# EAGLE design 5853-base-board (EAGLE 6.2)
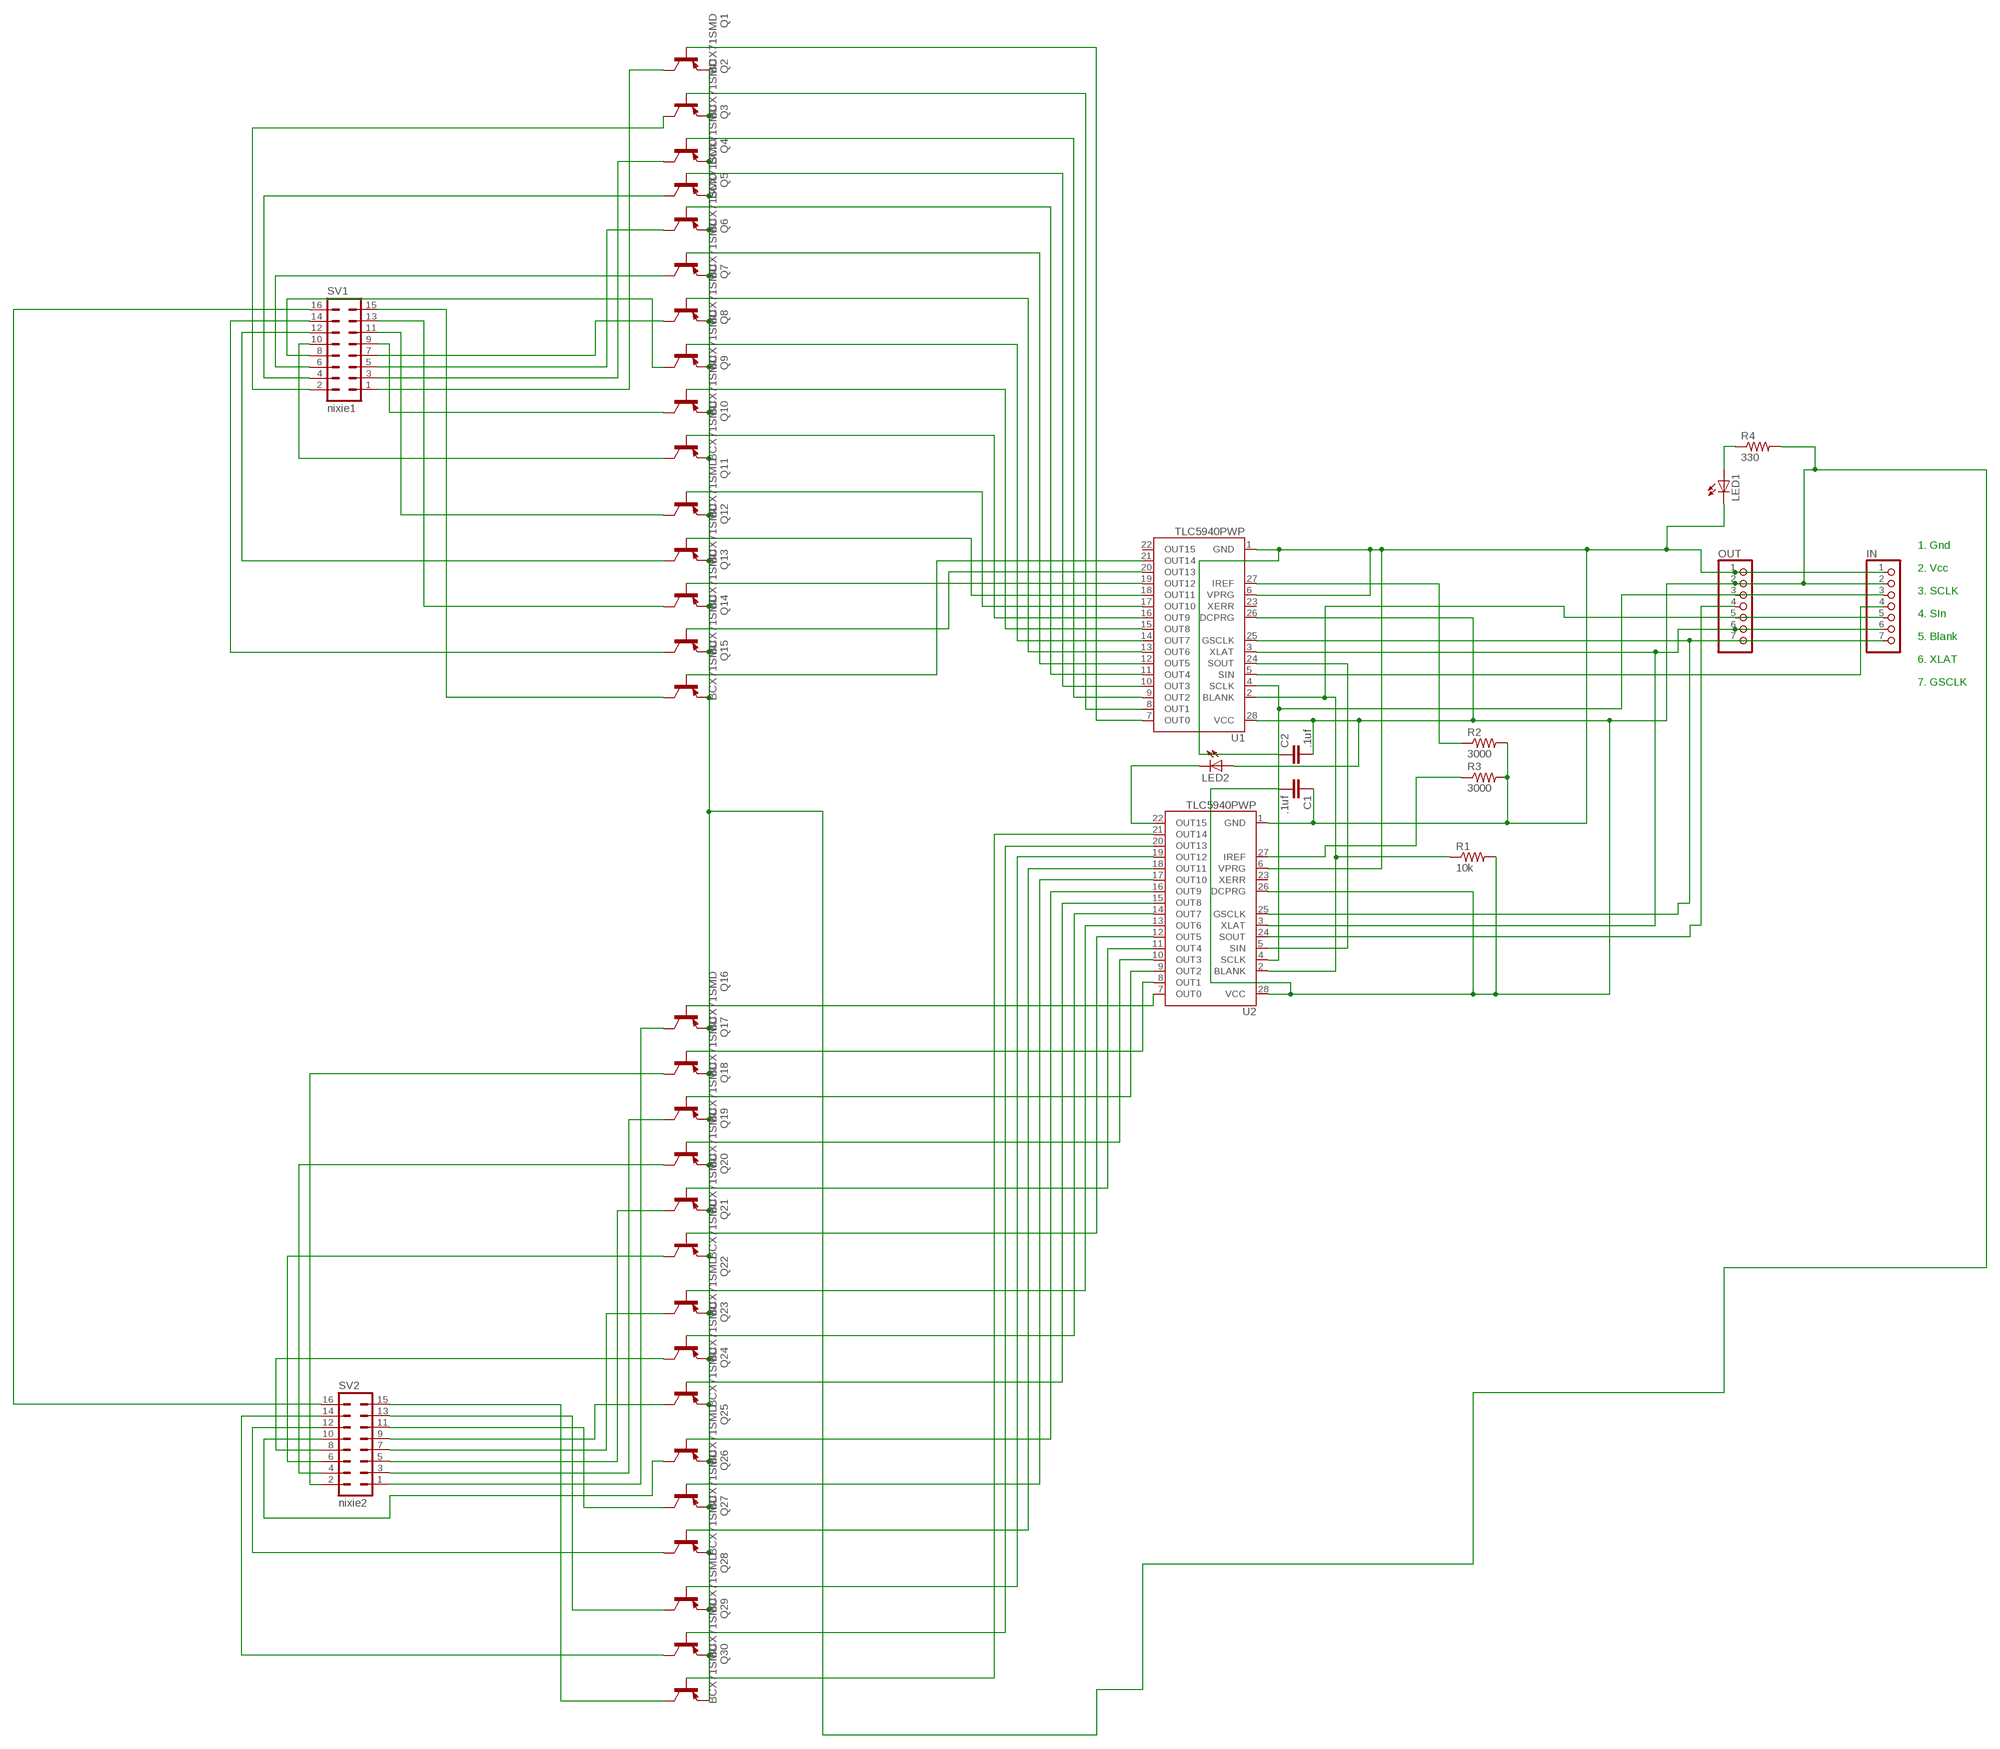
[diagram p0: schematic, sheet 1]

## Parts
C1  .1uf  C-EUC0805K  [C0805K]
C2  .1uf  C-EUC0805K  [C0805K]
IN  PINHD-1X7  [1X07]
LED1  LEDCHIPLED_0603  [CHIPLED_0603]
LED2  LEDCHIPLED_0603  [CHIPLED_0603]
OUT  PINHD-1X7  [1X07]
Q1  BCX71SMD  [SOT23]
Q2  BCX71SMD  [SOT23]
Q3  BCX71SMD  [SOT23]
Q4  BCX71SMD  [SOT23]
Q5  BCX71SMD  [SOT23]
Q6  BCX71SMD  [SOT23]
Q7  BCX71SMD  [SOT23]
Q8  BCX71SMD  [SOT23]
Q9  BCX71SMD  [SOT23]
Q10  BCX71SMD  [SOT23]
Q11  BCX71SMD  [SOT23]
Q12  BCX71SMD  [SOT23]
Q13  BCX71SMD  [SOT23]
Q14  BCX71SMD  [SOT23]
Q15  BCX71SMD  [SOT23]
Q16  BCX71SMD  [SOT23]
Q17  BCX71SMD  [SOT23]
Q18  BCX71SMD  [SOT23]
Q19  BCX71SMD  [SOT23]
Q20  BCX71SMD  [SOT23]
Q21  BCX71SMD  [SOT23]
Q22  BCX71SMD  [SOT23]
Q23  BCX71SMD  [SOT23]
Q24  BCX71SMD  [SOT23]
Q25  BCX71SMD  [SOT23]
Q26  BCX71SMD  [SOT23]
Q27  BCX71SMD  [SOT23]
Q28  BCX71SMD  [SOT23]
Q29  BCX71SMD  [SOT23]
Q30  BCX71SMD  [SOT23]
R1  10k  R-US_R0603  [R0603]
R2  3000  R-US_R0603  [R0603]
R3  3000  R-US_R0603  [R0603]
R4  330  R-US_R0603  [R0603]
SV1  nixie1  ML16  [ML16]
SV2  nixie2  ML16  [ML16]
U1  TLC5940PWP  [TSSOP28-GROUNDPAD]
U2  TLC5940PWP  [TSSOP28-GROUNDPAD]

## Nets
N$1: C1.2 C2.2 IN.2 LED2.A OUT.2 Q1.2(E) Q2.2(E) Q3.2(E) Q4.2(E) Q5.2(E) Q6.2(E) Q7.2(E) Q8.2(E) Q9.2(E) Q10.2(E) Q11.2(E) Q12.2(E) Q13.2(E) Q14.2(E) Q15.2(E) Q16.2(E) Q17.2(E) Q18.2(E) Q19.2(E) Q20.2(E) Q21.2(E) Q22.2(E) Q23.2(E) Q24.2(E) Q25.2(E) Q26.2(E) Q27.2(E) Q28.2(E) Q29.2(E) Q30.2(E) R1.2 R4.2 U1.26(DCPRG) U1.28(VCC) U2.26(DCPRG) U2.28(VCC)
N$2: C1.1 C2.1 IN.1 LED1.C OUT.1 R2.2 R3.2 U1.1(GND) U1.6(VPRG) U2.1(GND) U2.6(VPRG)
N$3: Q1.1(B) U1.7(OUT0)
N$4: LED2.C U2.22(OUT15)
N$5: SV1.16 SV2.16
N$6: Q2.1(B) U1.8(OUT1)
N$7: Q3.1(B) U1.9(OUT2)
N$8: Q4.1(B) U1.10(OUT3)
N$9: Q5.1(B) U1.11(OUT4)
N$10: Q6.1(B) U1.12(OUT5)
N$11: Q7.1(B) U1.13(OUT6)
N$13: Q8.1(B) U1.14(OUT7)
N$15: Q9.1(B) U1.15(OUT8)
N$18: Q10.1(B) U1.16(OUT9)
N$19: Q11.1(B) U1.17(OUT10)
N$20: Q12.1(B) U1.18(OUT11)
N$21: Q13.1(B) U1.19(OUT12)
N$22: Q14.1(B) U1.20(OUT13)
N$23: Q15.1(B) U1.21(OUT14)
N$24: Q16.1(B) U2.7(OUT0)
N$25: Q17.1(B) U2.8(OUT1)
N$26: Q18.1(B) U2.9(OUT2)
N$27: Q19.1(B) U2.10(OUT3)
N$28: Q20.1(B) U2.11(OUT4)
N$29: Q21.1(B) U2.12(OUT5)
N$30: Q22.1(B) U2.13(OUT6)
N$31: Q23.1(B) U2.14(OUT7)
N$32: Q24.1(B) U2.15(OUT8)
N$33: Q25.1(B) U2.16(OUT9)
N$34: Q26.1(B) U2.17(OUT10)
N$35: Q27.1(B) U2.18(OUT11)
N$36: Q28.1(B) U2.19(OUT12)
N$37: Q29.1(B) U2.20(OUT13)
N$38: Q30.1(B) U2.21(OUT14)
N$39: IN.4 U1.5(SIN)
N$40: OUT.4 U2.24(SOUT)
N$41: U1.24(SOUT) U2.5(SIN)
N$43: IN.5 OUT.5 R1.1 U1.2(BLANK) U2.2(BLANK)
N$44: R2.1 U1.27(IREF)
N$45: IN.7 OUT.7 U1.25(GSCLK) U2.25(GSCLK)
N$46: R3.1 U2.27(IREF)
N$49: LED1.A R4.1
N$50: IN.6 OUT.6 U1.3(XLAT) U2.3(XLAT)
N$53: IN.3 OUT.3 U1.4(SCLK) U2.4(SCLK)
N$74: Q1.3(C) SV1.1
N$75: Q2.3(C) SV1.2
N$76: Q3.3(C) SV1.3
N$77: Q4.3(C) SV1.4
N$78: Q5.3(C) SV1.5
N$79: Q6.3(C) SV1.6
N$80: Q7.3(C) SV1.7
N$81: Q8.3(C) SV1.8
N$82: Q9.3(C) SV1.9
N$83: Q10.3(C) SV1.10
N$84: Q11.3(C) SV1.11
N$85: Q12.3(C) SV1.12
N$86: Q13.3(C) SV1.13
N$87: Q14.3(C) SV1.14
N$88: Q15.3(C) SV1.15
N$89: Q16.3(C) SV2.1
N$90: Q17.3(C) SV2.2
N$91: Q18.3(C) SV2.3
N$92: Q19.3(C) SV2.4
N$93: Q20.3(C) SV2.5
N$94: Q21.3(C) SV2.6
N$95: Q22.3(C) SV2.7
N$96: Q23.3(C) SV2.8
N$97: Q24.3(C) SV2.9
N$98: Q25.3(C) SV2.10
N$99: Q26.3(C) SV2.11
N$100: Q27.3(C) SV2.12
N$101: Q28.3(C) SV2.13
N$102: Q29.3(C) SV2.14
N$103: Q30.3(C) SV2.15
Unconnected: U1.22(OUT15) U1.23(XERR) U2.23(XERR)

## Notes on the sheet
- 1. Gnd
- 2. Vcc
- 3. SCLK
- 4. SIn
- 5. Blank
- 6. XLAT
- 7. GSCLK

## Library data of the parts
C1 C2 = resistor:C-EU: CAPACITOR, European symbol
IN OUT = pinhead:PINHD-1X7: PIN HEADER
LED1 LED2 = led:LED: LED OSRAM: - CHIPLED LG R971, LG N971, LY N971, LG Q971, LY Q971, LO R971, LY R971 LH N974, LH R974 LS Q976, LO Q976, LY Q976 LO Q996 - Hyper CHIPLED LW Q18S LB Q993, LB Q99A, LB R99A - SideLED LS A670, LO A670, LY A670, LG A670, LP A670 LB A673, LV A673, LT A673, LW A673 LH A674 LY A675 LS A676, LA A676, LO A676, LY A676, LW A676 LS A679, LY A679, LG A679 - Hyper Micro SIDELED® LS Y876, LA Y876, LO Y876, LY Y876 LT Y87S - SmartLED LW L88C, LW L88S LB L89C, LB L89S, LG L890 LS L89K, LO L89K, LY L89K LS L896, LA L896, LO L896, LY L896 - TOPLED LS T670, LO T670, LY T670, LG T670, LP T670 LSG T670, LSP T670, LSY T670, LOP T670, LYG T670 LG T671, LOG T671, LSG T671 LB T673, LV T673, LT T673, LW T673 LH T674 LS T676, LA T676, LO T676, LY T676, LB T676, LH T676, LSB T676, LW T676 LB T67C, LV T67C, LT T67C, LS T67K, LO T67K, LY T67K, LW E67C LS E67B, LA E67B, LO E67B, LY E67B, LB E67C, LV E67C, LT E67C LW T67C LS T679, LY T679, LG T679 LS T770, LO T770, LY T770, LG T770, LP T770 LB T773, LV T773, LT T773, LW T773 LH T774 LS E675, LA E675, LY E675, LS T675 LS T776, LA T776, LO T776, LY T776, LB T776 LHGB T686 LT T68C, LB T68C - Hyper Mini TOPLED® LB M676 - Mini TOPLED Santana® LG M470 LS M47K, LO M47K, LY M47K Source: http://www.osram.convergy.de LUXEON: - LUMILED® LXK2-PW12-R00, LXK2-PW12-S00, LXK2-PW14-U00, LXK2-PW14-V00 LXK2-PM12-R00, LXK2-PM12-S00, LXK2-PM14-U00 LXK2-PE12-Q00, LXK2-PE12-R00, LXK2-PE12-S00, LXK2-PE14-T00, LXK2-PE14-U00 LXK2-PB12-K00, LXK2-PB12-L00, LXK2-PB12-M00, LXK2-PB14-N00, LXK2-PB14-P00, LXK2-PB14-Q00 LXK2-PR12-L00, LXK2-PR12-M00, LXK2-PR14-Q00, LXK2-PR14-R00 LXK2-PD12-Q00, LXK2-PD12-R00, LXK2-PD12-S00 LXK2-PH12-R00, LXK2-PH12-S00 LXK2-PL12-P00, LXK2-PL12-Q00, LXK2-PL12-R00 Source: www.luxeon.com KINGBRIGHT: KA-3528ASYC Source: www.kingbright.com
Q1-Q30 = transistor-pnp:BCX71SMD: PNP Transistor
R1-R4 = resistor:R-US_: RESISTOR, American symbol
SV1 SV2 = con-ml:ML16: HARTING; OC_FARNELL: unknown; OC_NEWARK: unknown
U1 U2 = SparkFun:TLC5940: TI TLC5940 16-channel LED Driver with Dot Correction and Grayscale PWM Control The TLC5940 is a 16-channel, constant-current sink LED driver. Each channel has an individually adjustable 4096-step grayscale PWM brightness control and a 64-step, constant-current sink (dot correction). The dot correction adjusts the brightness variations between LED channels and other LED drivers. The dot correction data is stored in an integrated EEPROM. Both grayscale control and dot correction are accessible via a serial interface. A single external resistor sets the maximum current value of all 16 channels. Packages: 28-pin HTSSOP 32-pin 5x5mm QFN 28-pin DIP

## Board
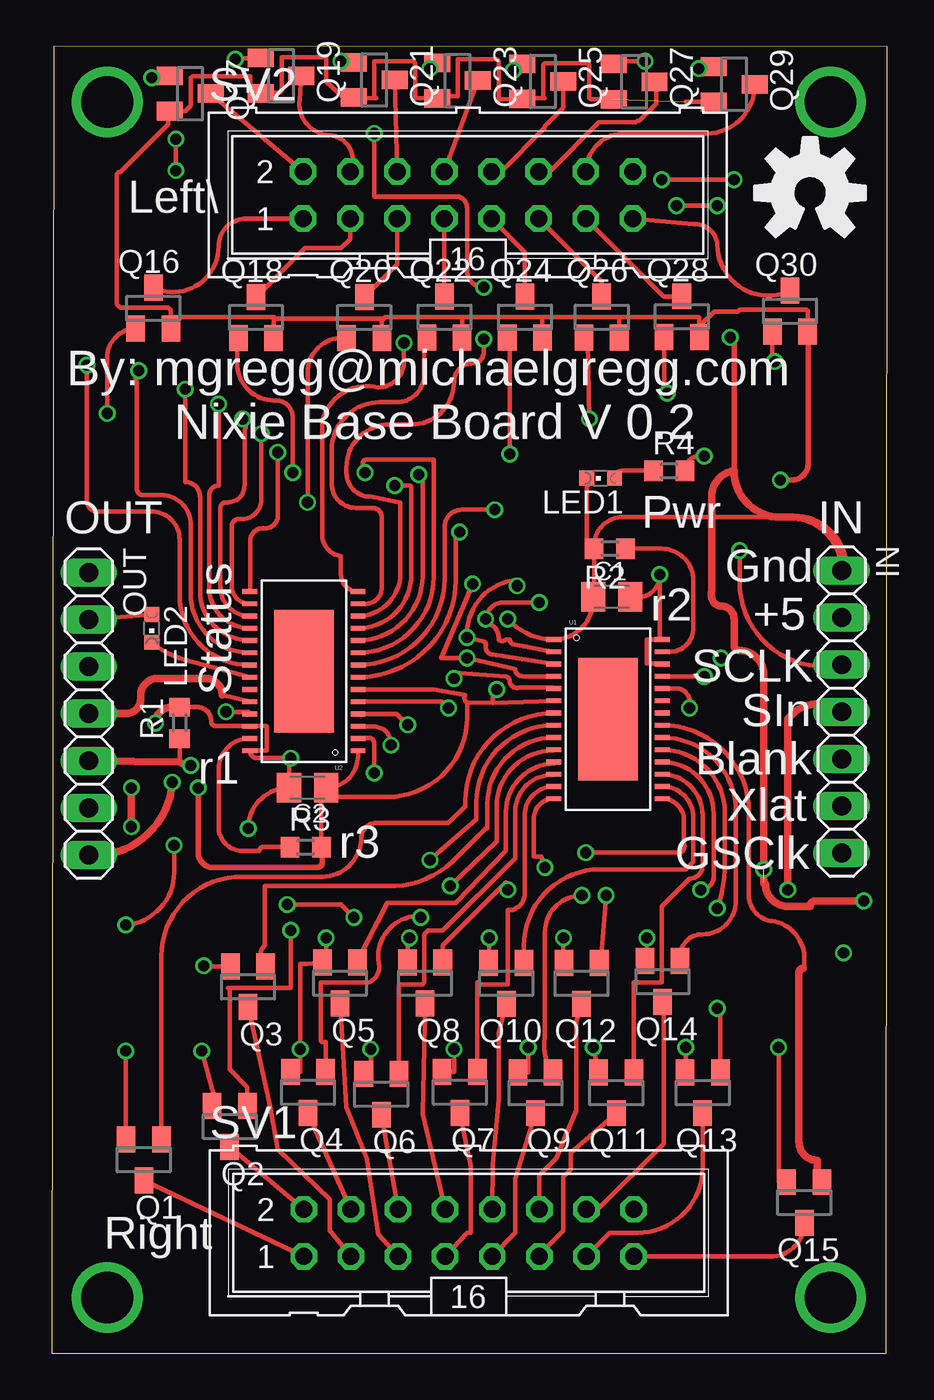
[diagram p1: board, top side]
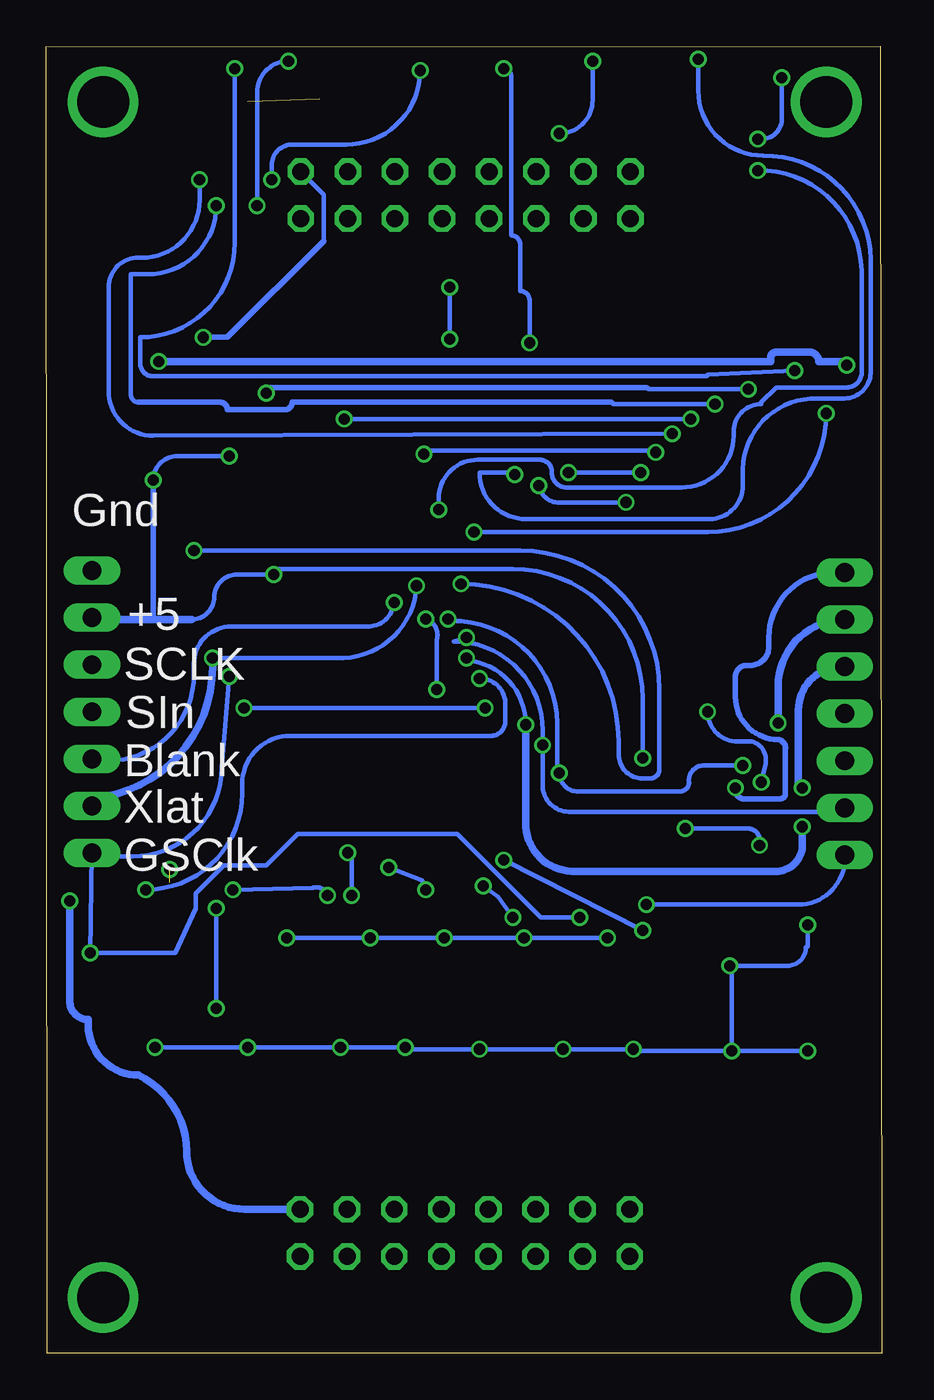
[diagram p2: board, bottom side, seen from below]

Size 45.06 x 70.5 mm. Coordinates in mm from the lower left corner, seen from the top.
Outline: 0,0 45,0 45.06,70.47 0.1,70.5 0,0
Copper layers (1*16): Top 0.035mm / dielectric 1.5mm / Bottom 0.035mm
Design rules "default": minimum track width 0.099059375mm, minimum drill 12mil, track to track 6mil, track to pad 6mil, pad to pad 6mil, via to via 6mil, smd to smd 0mil, copper to edge 10mil, drill to drill 10mil, minimum pad ring 10mil, minimum via ring 6mil, stop-mask expansion 2mil, vias tented up to drill 100mil, thermal gap 10mil

### Footprints (pad centres in the part's own frame; a part is rotated, then mirrored left to right if it is on the bottom)
C0805K = smd 1.3 x 1.6: 1 -1,0; 2 1,0
1X07 = drill 1.016 long: 1 -7.62,0; 2 -5.08,0; 3 -2.54,0; 4 0,0; 5 2.54,0; 6 5.08,0; 7 7.62,0
CHIPLED_0603 = smd 0.8 x 0.8: A 0,-0.75; C 0,0.75
SOT23 = smd 1 x 1.4: 1 -0.95,-1.1; 2 0.95,-1.1; 3 0,1.1
R0603 = smd 1 x 1.1: 1 -0.85,0; 2 0.85,0
ML16 = drill 0.914 octagon: 1 -8.89,-1.27; 2 -8.89,1.27; 3 -6.35,-1.27; 4 -6.35,1.27; 5 -3.81,-1.27; 6 -3.81,1.27; 7 -1.27,-1.27; 8 -1.27,1.27; 9 1.27,-1.27; 10 1.27,1.27; 11 3.81,-1.27; 12 3.81,1.27; 13 6.35,-1.27; 14 6.35,1.27; 15 8.89,-1.27; 16 8.89,1.27
TSSOP28-GROUNDPAD = smd 0.8 x 0.25: 1 -2.921,4.298; 2 -2.921,3.637; 3 -2.921,2.977; 4 -2.921,2.317; 5 -2.921,1.656; 6 -2.921,0.996; 7 -2.921,0.335; 8 -2.927,-0.325; 9 -2.921,-0.985; 10 -2.921,-1.646; 11 -2.921,-2.306; 12 -2.921,-2.967; 13 -2.921,-3.627; 14 -2.921,-4.287; 15 2.921,-4.287; 16 2.921,-3.627; 17 2.921,-2.967; 18 2.921,-2.306; 19 2.921,-1.646; 20 2.921,-0.985; 21 2.927,-0.325; 22 2.921,0.335; 23 2.921,0.996; 24 2.921,1.656; 25 2.921,2.317; 26 2.921,2.977; 27 2.921,3.637; 28 2.921,4.298 | smd 3.2 x 6.6: 29 0,0.005

### Placement (x,y rotation side)
C1  30.2,40.8 0 top
C2  13.8,30.5 180 top
IN  42.6,34.6 270 top
LED1  29.6,47.2 90 top
LED2  5.4,39.1 180 top
OUT  2,34.5 270 top
Q1  4.97,10.43 180 top
Q2  9.6,12.23 180 top
Q3  10.59,19.77 180 top
Q4  13.82,14.07 180 top
Q5  15.55,19.97 180 top
Q6  17.78,13.97 180 top
Q7  22.01,14.07 180 top
Q8  20.14,19.97 180 top
Q9  26.09,14.05 180 top
Q10  24.52,19.95 180 top
Q11  30.45,14.05 180 top
Q12  28.58,19.95 180 top
Q13  35.11,14.05 180 top
Q14  32.94,20.05 180 top
Q15  40.59,8.13 180 top
Q16  5.48,56.37 0 top
Q17  7.47,67.95 270 top
Q18  11.02,55.87 0 top
Q19  12.37,68.91 270 top
Q20  16.86,55.87 0 top
Q21  17.39,68.69 270 top
Q22  21.18,55.89 0 top
Q23  21.89,68.65 270 top
Q24  25.52,55.89 0 top
Q25  26.49,68.61 270 top
Q26  29.66,55.89 0 top
Q27  31.41,68.59 270 top
Q28  33.98,55.91 0 top
Q29  36.81,68.45 270 top
Q30  39.82,56.21 0 top
R1  6.9,34 90 top
R2  30.1,43.4 180 top
R3  13.7,27.3 0 top
R4  33.3,47.6 0 top
SV1  22.49,6.49 0 top
SV2  22.45,62.48 0 top
U1  30,34.2 0 top
U2  13.6,36.8 180 top

### Tracks (layer width: path | path; a pad name or v marks a point on that pad's centre or on a via)
N$1  (via drill 0.6)  (1 unrouted)
  Top 0.254: Q13.2 34.2,15.15 v34.2,16.5 | v29.2,16.5 Q11.2 | Q9.2 25.7,15.15 v25.7,16.5 | Q7.2 21.7,15.17 v21.7,16.4 | Q6.2 17.2,15.17 v17.2,16.4 | Q4.2 13.4,15.17 v13.4,16.4 13.4,21 13.8,21 Q5.2 14.8,21.07 v14.8,22.4 | Q2.2 8.9,13.33 v8.1,16.3 | Q3.2 8.7,20.87 v8.2,20.9 | Q1.2 4,11.53 v4,16.3 | Q15.2 39.2,9.23 v39.2,16.5 | Q16.2 6.43,55.9 | 6.43,55.9 6.43,56.27 6.3,56.4 3.7,56.4 3.5,56.6 3.5,63.6 3.6,63.7 3.7,63.7 6.3,66.3 6.3,66.93 Q17.2 7.2,67 7.5,67.3 7.5,68.8 7.6,68.9 10.7,68.9 10.7,68.03 Q19.2 11.31,68 12.3,68 12.4,68.1 12.4,69.9 14.8,69.9 14.8,68.6 15.76,67.74 Q21.2 16.33,67.7 17.5,67.7 17.4,67.8 17.4,69.7 19.5,69.7 19.6,69.6 19.6,67.7 Q23.2 20.89,67.8 21.9,67.8 21.9,69.8 24,69.8 24.1,69.7 24.1,67.6 24.16,67.66 Q25.2 25.43,67.7 26.6,67.7 26.5,67.8 26.5,69.5 26.6,69.6 28.9,69.6 29,69.5 29,67.7 29.06,67.64 Q27.2 | Q18.2 11.97,55.87 12,55.9 | 12,55.9 6.43,55.9 | Q20.2 17.81,55.71 17.9,55.8 | 17.9,55.8 12.1,55.8 12,55.9 | Q22.2 22.13,55.87 22.1,55.9 | 22.1,55.9 18,55.9 17.9,55.8 | Q24.2 26.47,55.87 26.5,55.9 | 26.5,55.9 22.1,55.9 | Q26.2 30.61,55.89 30.6,55.9 | 30.6,55.9 26.5,55.9 | Q28.2 34.93,55.4 | 34.93,55.4 34.93,55.87 34.9,55.9 30.6,55.9 | Q30.2 40.77,56.23 40.7,56.3 37.1,56.3 37,56.2 35.73,56.2 34.93,55.4 | Q29.2 34.2,67.5 | C1.2 arc106 v32.8,42 32.8,38.62 arc90 U1.28 32.1,38.5 arc-90 32.1,38.5 32.1,37.2 32.9,37.2 arc-90 U1.26 | R1.2 7.85,34.85 arc-90 8.6,34.1 arc90 8.88,33.82 U2.26 11.58,33.82 arc-90 11.6,33.8 11.6,32.5 U2.28 arc-90 U2.28 arc90 11.08,32.1 v12.9,32.1 arc90 12.8,32 C2.2 arc90 v10.6,28.3 | LED2.A OUT.2 | v19.3,22.4 19.19,22.4 Q8.2 | Q10.2 23.6,21.05 v23.6,22.4
  Top 0.254: Q12.2 27.7,21.05 27.7,21.1 27.6,21.1 v27.6,22.4 | Q14.2 32.1,21.15 v32.1,22.4 | v6.6,27.4 6.6,26.2 arc-90 v4,23.1 | R4.2 arc-90 34.95,48.4 v35.2,48.4
  Top 0.305: Q30.2 arc-90 40.8,55.08 40.8,48 arc-90 39.9,47.1 v39.3,47.1
  Top 0.406: R1.2 6.45,34.85 arc90 v5.6,34
  Bottom 0.254: v8.1,16.3 13.4,16.3 v13.4,16.4 v17.2,16.4 v21.7,16.4 25.7,16.4 v25.7,16.5 v29.2,16.5 v34.2,16.5 v39.2,16.5 | v8.1,16.3 8.1,20.9 v8.2,20.9 5.1,20.9 arc-90 4.1,21.9 arc-90 4,22 v4,23.1 | v4,16.3 v8.1,16.3 | v12.9,32.1 12.9,35.3 arc-90 19.9,42.3 32.9,42.3 arc-90 v32.8,42 34.8,42 arc-90 36,40.8 arc90 37.22,39.58 | v14.8,22.4 v19.3,22.4 v23.6,22.4 v27.6,22.4 v32.1,22.4 | v10.6,28.3 7.2,28.3 arc90 6.6,27.7 v6.6,27.4 | v35.2,48.4 38,48.4 arc-90 v39.3,47.1
  Bottom 0.305: v39.3,47.1 39.3,39.78 arc90 39.5,39.58
  Bottom 0.406: v5.6,34 5.6,35.98 arc90 OUT.2 | IN.2 arc-90 42.5,39.58 39.5,39.58 37.22,39.58
N$2  (via drill 0.6)
  Top 0.254: U1.6 23.78,35.08 | 23.78,35.08 22.4,35.1 | 22.4,35.1 arc-90 22.3,35.5 20.6,35.8 U2.6 | U2.1 16.52,32.22 arc-90 C2.1 | R3.2 14.55,30.25 arc-90 C2.1 | v24,35.8 arc90 23.78,36.08 23.78,35.08 | R2.2 29.25,40.85 arc-90 C1.1 29.2,40.62 arc-90 U1.1 arc-48 v24.6,39.6 | IN.1 arc90 39.62,45.1 30.8,45.1 arc90 29.25,43.55 R2.2 | 22.4,35.1 22.4,34.3 arc-90 18.1,30 15.3,30 arc-90 C2.1 | LED1.C 28.85,43.8 arc90 R2.2
  Top 0.305: v7.9,30.5 7.9,27 arc90 8.7,26.2 14.3,26.2 arc90 14.6,26.5 14.6,27.25 arc90 R3.2
  Bottom 0.254: v24.6,39.6 arc90 24,38.5 v24,35.8
  Bottom 0.305: OUT.1 2.58,42.12 arc-90 6.1,38.6 6.1,38.1 arc90 7.1,37.1 7.3,37.1 arc-90 7.9,36.5 7.9,35.4 arc-90 5.6,33.1 arc90 5.2,32.6 5.2,30.2 arc90 5.5,29.9 7.5,29.9 arc90 v7.9,30.5
N$3
  Top 0.254: U1.7 arc90 22.3,29.76 22.3,29.5 21.4,28.6 17.5,28.6 arc90 16.7,27.8 16.7,27.7 arc-90 14.4,25.7 9.9,25.7 arc90 5.92,21.02 Q1.1
N$4
  Top 0.254: U2.22 7.2,37.4 arc-26 LED2.C
N$5  (via drill 0.6 pad 0.25)  (1 unrouted)
  Top 0.305: v36.6,54.8 36.8,54.6 36.8,47.6
  Top 0.406: 42.8,42.3 arc90 40,45.1 39.3,45.1 arc-90 36.8,47.6 arc90 35.6,46 35.6,41.1 arc90 36,40.3 arc-98 36.8,39.6 36.8,38.2 arc90 37.1,37.9 arc-90 38.4,36.6 38.4,25.4 arc90 38.5,25.3 arc90 39.7,24.1 40.9,24.1 arc-90 41.2,24.4 v43.8,24.4
  Bottom 0.254: SV2.16 30.1,62.51 30.1,60
  Bottom 0.305: 30.1,60 35.3,54.8 v36.6,54.8
  Bottom 0.406: SV1.16 34.36,7.76 arc90 37.5,10.9 arc-65 40.1,15 arc90 42.8,17.7 42.8,18 arc90 43.8,19 v43.8,24.4
  other vias: 38.4,26.1
N$6  (via drill 0.6)
  Top 0.254: U1.8 arc90 22.9,29.7 22.9,28.8 v20.4,26.6 | v12.9,22.8 12.9,19.7 9.5,19.7 9.6,19.6 9.6,15.3 10.55,14.35 Q2.1
  Bottom 0.254: v20.4,26.6 v12.9,22.8
N$7
  Top 0.254: U1.9 arc90 23.5,29.64 23.5,28.3 23.4,28.3 21.6,26.5 arc-45 18.1,25.2 11.5,25.2 11.5,22 arc98 Q3.1
N$8  (via drill 0.6)
  Top 0.254: U1.10 arc-90 27.02,32.5 27,32.5 arc90 24,29.5 24,27.6 v21.5,25.2 | v19.9,23.5 19.9,23.6 arc90 17.6,21.4 17.6,21.2 arc-90 17.1,20 14.5,20 14.5,16.9 arc90 14.6,16.8 14.77,16.8 Q4.1
  Bottom 0.254: v21.5,25.2 20.7,24.6 v19.9,23.5
N$9
  Top 0.254: U1.11 arc-90 27.1,31.87 27.1,31.8 arc90 24.5,29.2 24.5,27.1 21.8,24.3 18.1,24.3 16.5,21.2 Q5.1
N$10
  Top 0.254: U1.12 arc-90 27.05,31.2 27,31.2 arc90 25,29.2 25,26.7 21.1,22.8 20.3,22.8 20.1,22.6 20.1,20 20,19.9 18.8,19.9 18.73,19.83 Q6.1
N$11
  Top 0.254: U1.13 arc90 25.5,28.99 25.5,25 arc-90 24.8,23.9 24.6,23.9 24.6,19.9 23,19.9 23,20 22.96,20 Q7.1
N$13  (via drill 0.6)
  Top 0.254: U1.14 arc90 26,28.83 26,26.8 26.4,26.8 v26.6,26.2 | v24.6,25 24.5,25.4 21.09,21.99 Q8.1
  Bottom 0.254: v26.6,26.2 24.8,25.5 v24.6,25
N$14
  Top 0.2: 41.69,60.69 arc9 41.99,60.85 42.75,60.24 43.26,60.75 42.65,61.51 arc19 42.91,62.14 43.88,62.23 43.88,62.97 42.91,63.06 arc19 42.65,63.69 43.26,64.45 42.75,64.96 41.99,64.35 arc19 41.36,64.61 41.27,65.58 40.53,65.58 40.44,64.61 arc19 39.81,64.35 39.05,64.96 38.54,64.45 39.15,63.69 arc19 38.89,63.06 37.92,62.97 37.92,62.23 38.89,62.14 arc19 39.15,61.51 38.54,60.75 39.05,60.24 39.81,60.85 arc9 40.11,60.69 40.54,61.73 arc-68 39.96,62.6 arc-248 41.26,61.73 41.69,60.69
N$15  (via drill 0.6)
  Top 0.254: U1.15 arc-90 34.1,28.73 34.1,27.5 arc-90 33.9,27 v28.8,27 | v28.6,24.7 arc90 26.6,22.7 26.6,17 arc49 Q9.1
  Bottom 0.254: v28.8,27 arc90 28.6,27.1 v28.6,24.7
N$16  (via drill 2.8)
  other vias: 3,3
N$17  (via drill 2.8)
  other vias: 42,3
N$18
  Top 0.254: U1.16 arc-90 34.6,28.89 34.6,26.5 34.2,26.1 29.6,26.1 arc90 25.47,21.97 Q10.1
N$19
  Top 0.254: U1.17 arc-90 35.1,29.05 35.1,26.3 arc-90 34.4,25.6 32.9,24.1 32.9,20 31.4,20 Q11.1
N$20  (via drill 0.6)
  Top 0.254: U1.18 arc-90 35.7,29.11 35.7,25.7 arc-90 v35,25 | v29.9,24.7 29.6,21.12 arc-90 Q12.1
  Bottom 0.254: v35,25 30.7,25.1 arc90 v29.9,24.7
N$21  (via drill 0.6)
  Top 0.254: U1.19 arc-90 36.3,29.18 36.3,26.5 arc-22 v35.9,24 | v35.9,18.6 36.06,18.6 Q13.1
  Bottom 0.254: v35.9,24 v35.9,18.6
N$22
  Top 0.254: U1.20 arc-90 36.9,29.24 36.9,24.4 arc-90 35.1,22.6 arc100 Q14.1
N$23
  Top 0.254: U1.21 arc-90 37.6,29.2 37.6,24.7 arc90 39,23.3 arc-90 40.54,20.76
  Top 0.406: 40.54,20.76 arc90 40.3,20.52 40.3,11.4 arc90 41.3,10.4 41.3,9.47 arc90 Q15.1
N$24  (via drill 0.6 pad 0.25)
  Top 0.254: U2.7 arc90 21.8,41.74 21.8,43.8 arc-90 22.2,44.3 v22,44.3 | v3,50.7 3,53.74 arc-90 Q16.1
  Bottom 0.254: v22,44.3 9.4,44.3 arc-90 v3,50.7
N$25  (via drill 0.6 pad 0.25)
  Top 0.254: U2.8 arc90 21.2,41.8 21.2,44.6 arc-90 22.1,45.5 v23.9,45.5 | v6.7,63.8 v6.7,65.5 | v5.4,68.8 6.27,68.8 arc90 Q17.1
  Bottom 0.254: v23.9,45.5 23.9,46.1 arc90 21.8,48.2 18.4,48.2 arc90 17.8,47.5 arc-90 17,46.7 10.8,46.7 arc-90 8,49.5 8,49.7 arc90 6.5,51.2 6.5,51.3 5.7,52.1 2,52.1 arc-90 1.1,52.8 1.1,58.4 arc-90 v6.7,63.8 | v6.7,65.5 6.4,65.5 arc-90 5.4,66.7 v5.4,68.8
N$26  (via drill 0.6 pad 0.25)
  Top 0.254: U2.9 arc90 20.6,41.86 20.6,48.2 16.9,48.2 arc90 16.8,47.9 16.8,47.6 arc90 v16.9,47.5 | Q18.1 arc90 10,54.7 10,53.4 arc90 12,51.4 12.1,51.4 arc-90 13,50.5 v13,47.5
  Bottom 0.254: v16.9,47.5 v13,47.5
N$27  (via drill 0.6 pad 0.25)
  Top 0.254: U2.10 arc90 20,41.92 20,47.4 v19.8,47.4 | v9.9,69.8 arc-90 9.96,69.86 Q19.1
  Bottom 0.254: v19.8,47.4 arc-90 19.9,47.5 21.7,47.5 arc-90 19.2,45 9.3,45 arc-90 7.5,46.8 7.5,47.7 arc90 3.5,51.5 2,51.5 arc-90 0.6,53 0.6,59 arc-90 6.4,64.6 arc90 9.9,68.1 v9.9,69.8
N$28  (via drill 0.6 pad 0.25)
  Top 0.254: U2.11 arc90 19.4,41.98 19.4,46.7 arc90 19.3,46.8 v18.5,46.8 | v13.8,45.9 13.8,52.9 arc-90 15.67,54.77 Q20.1
  Bottom 0.254: v18.5,46.8 arc-90 17.2,45.9 v13.8,45.9
N$29  (via drill 0.6 pad 0.25)
  Top 0.254: U2.12 arc90 18.8,42.05 18.8,45.9 17.2,46.2 arc-90 15.9,47.5 15.9,47.8 arc-90 18.2,50.1 19.4,50.1 arc90 21.7,52.4 arc-90 22.7,53.4 arc90 23.3,54 v23.3,54.7 | v23.3,57.5 arc-90 22.4,58.4 22.4,61.8 arc90 21.8,62.4 17.4,62.4 v17.4,65.8 | v15.6,69.7 arc90 15.66,69.64 Q21.1
  Bottom 0.254: v23.3,54.7 v23.3,57.5 | v17.4,65.8 arc-90 15.6,67.6 v15.6,69.7
N$30
  Top 0.254: U2.13 16.93,40.43 arc90 17.8,41.3 17.8,45.1 arc90 17.3,45.6 16.4,45.6 arc-90 15.1,46.9 15.1,48.7 arc-90 17.7,51.3 18.6,51.3 arc90 20.1,52.8 20.1,54.66 arc-90 Q22.1
N$31  (via drill 0.6 pad 0.25)
  Top 0.254: v19,54.5 19,53.5 arc-90 17.6,52.1 arc90 14.6,50.3 14.6,44.3 arc90 15.6,43 15.6,42.01 arc90 U2.14 | v20.4,69.3 20.49,69.3 arc90 Q23.1
  Bottom 0.254: v19,54.5 19,56.8 arc-90 19.5,57.3 19.5,59.8 arc-90 20,60.3 20,68.9 arc-90 v20.4,69.3
N$32  (via drill 0.6 pad 0.25)
  Top 0.254: U2.15 arc90 10.7,41.11 10.7,43.8 arc-90 11.4,44.5 arc90 12.2,45.1 v12.2,48.6 | v24.7,48.5 24.7,54.66 arc90 Q24.1
  Bottom 0.254: v12.2,48.6 12.5,48.6 arc-90 12.5,48.7 24.5,48.7 arc-90 v24.7,48.5
N$33  (via drill 0.6 pad 0.25)
  Top 0.254: U2.16 arc-90 9.7,41.41 9.7,44.6 arc-90 10.1,45 10.2,45 arc90 11.3,46 v11.3,49.6 | v36.8,63.3 v32.9,63.3 | v24.9,69.2 25.03,69.2 arc90 Q25.1
  Bottom 0.254: v11.3,49.6 39.3,49.5 arc90 41.7,51.9 41.7,57.5 arc90 40.1,59.1 39.9,59.1 arc-90 36.8,62.2 v36.8,63.3 | v32.9,63.3 32.9,64.1 arc90 31.8,65.2 28.9,65.2 arc-90 v24.9,69.2
N$34  (via drill 0.6 pad 0.25)
  Top 0.254: U2.17 arc-90 9.1,41.35 9.1,45.6 arc-90 9.4,45.9 9.5,45.9 arc90 10.4,46.8 10.4,49.8 arc90 v10.3,50.4 | v29,50.4 28.9,54.6 arc90 Q26.1
  Bottom 0.254: v10.3,50.4 28.7,50.4 arc-90 v29,50.4
N$35  (via drill 0.6 pad 0.25)
  Top 0.254: U2.18 arc-90 8.5,41.28 8.5,46.3 arc-90 9,46.8 v9,51.2 | v35.9,61.9 v33.7,61.9 | v32,69.7 30.47,69.7 arc90 Q27.1
  Bottom 0.254: v9,51.2 14.5,51.2 arc-90 14.6,51.3 | 40.1,51.3 arc90 40.5,51.7 40.5,58.2 39.6,58.2 arc-90 v35.9,61.9 | v33.7,61.9 33.7,68 arc90 v32,69.7
  Bottom 0.305: 14.6,51.3 31.8,51.3 arc90 32.2,50.9 35.3,50.9 arc-90 35.7,51.3 40.1,51.3
N$36  (via drill 0.6 pad 0.25)
  Top 0.254: U2.19 arc-90 8,41.12 8,46.2 arc90 7.2,47 v7.2,52 | v33.2,51.8 arc-90 33.03,52.27 Q28.1
  Bottom 0.254: v7.2,52 12.6,52 arc-90 12.7,52.1
  Bottom 0.305: 12.7,52.1 32.9,52.1 arc-90 v33.2,51.8
N$37  (via drill 0.6 pad 0.25)
  Top 0.254: U2.20 arc-90 7.5,40.96 7.5,44.7 arc90 5.9,46.3 4.9,46.3 arc-90 4.6,46.6 4.6,52.4 arc-90 v4.7,53 | v34.9,69.3 arc-90 35,69.4 Q29.1
  Bottom 0.254: v4.7,53 9.4,52.8 arc90 9.5,52.7 39.3,52.7 arc90 40,53.4 40,54.8 arc-90 34.9,59.9 v34.9,69.3
N$38  (via drill 0.6 pad 0.25)
  Top 0.254: U2.21 arc-90 6.9,40.9 6.9,43.9 arc90 5.4,45.4 2.5,45.4 arc-90 1.9,46 v1.9,53.3 | v39,53.5 arc-90 38.87,53.63 Q30.1
  Bottom 0.254: v1.9,53.3 1.9,53.4 arc-90 2,53.5
  Bottom 0.406: 2,53.5 3.4,53.5 arc-90 3.9,54 5.7,54 arc-90 6,53.7 6,53.5 v39,53.5
N$39  (via drill 0.6)
  Top 0.254: U1.5 arc90 27.04,35.9 25.2,35.9 arc-90 24.7,36.2 arc90 24.5,36.5 22,36.7 arc90 v21.7,36.4
  Top 0.406: IN.4 arc90 39.7,34.2 v39.7,25
  Bottom 0.254: v21.7,36.4 arc90 20.3,35 20.3,34.1 arc90 21.1,33.3 31.9,33.3 arc-90 34.5,30.7 34.5,30.2 arc90 v39.7,25
N$40
  Top 0.254: U2.24 9.2,35.5
  Top 0.406: 9.2,35.5 arc90 8.3,36.4 5.7,36.4 arc90 4.8,35.5 4.8,35.3 arc-90 4,34.5 OUT.4
N$41  (via drill 0.6)
  Top 0.254: U2.5 21.04,35.14 arc90 v21.4,34.8 | v34.4,34.8 arc90 33.84,35.86 U1.24
  Bottom 0.254: v21.4,34.8 v34.4,34.8
N$42  (via drill 2.8 pad 3.81)
  other vias: 3,67.5
N$43  (via drill 0.6)
  Top 0.254: U1.2 24.96,38.24 arc-90 24.7,38.5 24.5,38.5 arc-90 24.1,38.5 arc90 23.4,39.4 v23.4,39.6 arc-90 24.5,40.5 v26.3,40.5 | v17.4,31.3 17.4,32.9 arc90 17.1,33.2 16.56,33.2 arc90 U2.2 | R1.1 6.9,31.9 arc90 v7.5,31.7
  Top 0.406: OUT.5 6.9,31.9
  Bottom 0.254: v23.4,39.6 23.2,39.5 arc90 17.5,34 17.5,31.4 arc-90 v17.4,31.3 arc-90 16.4,30.3 10.9,30.3 arc-90 10.4,30.8 arc90 9.7,31.7 v7.5,31.7 | IN.5 41.74,31.96 arc-90 37.1,36.6 37.1,37.2 arc90 35.1,39.2 27.9,39.2 arc-90 v26.3,40.5
N$44
  Top 0.254: U1.27 33.34,37.84 arc90 34.6,39.1 34.6,41.7 arc90 32.9,43.4 R2.1
N$45  (via drill 0.6)
  Top 0.254: U2.25 arc90 10.56,34.6 v9.4,34.6 | U1.25 arc90 32.94,36.5 v35.2,36.5 | v16.3,23.5 15.6,24.2 v12.7,24.2
  Top 0.406: v6.5,30.8 arc-91 OUT.7
  Bottom 0.254: v9.4,34.6 arc-90 7.8,33 7,33 arc90 6.3,31.7 v6.5,30.8 | v35.2,36.5 35.6,31.6 arc90 40.4,26.8 42.52,26.8 arc90 IN.7 v42.7,21.6 38.1,21.6 37,24 37,24.8 35.5,26.3 33.2,26.3 31.5,28 22.9,28 18.4,23.5 v16.3,23.5 | v12.7,24.2 4.5,24.2 arc-90 2,26.7 OUT.7
N$46
  Top 0.254: U2.27 arc90 9,31.48 9,28.4 arc90 10.3,27.1 11.2,27.1 arc-90 11.4,27.3 R3.1
N$47  (via drill 2.8 pad 3.81)
  other vias: 42,67.5
N$49
  Top 0.254: LED1.A arc-90 30.75,47.6 R4.1
N$50  (via drill 0.6)
  Top 0.254: U1.3 23.82,37.68 arc-90 23.4,38.1 arc90 23.3,38.4 v22.4,38.6 arc-90 25.1,41.7 v25.1,41.4 | v18.3,32.8 18.3,32.9 arc90 17.4,33.8 16.54,33.8 arc-90 U2.3
  Bottom 0.254: v22.4,38.6 23.1,38.4 arc90 18.3,33.6 v18.3,32.8 18.3,30.7 arc-90 16.9,29.2 2.12,29.2 arc-90 OUT.6 | v36.1,37.5 29.4,37.5 arc-90 v25.1,41.4
  Bottom 0.406: v36.1,37.5 36.1,37 arc90 43.2,29.9 42.98,29.9 arc90 IN.6
N$53  (via drill 0.6)
  Top 0.254: 22.48,37.52 arc-90 v22.4,37.5 | v19.2,33.9 18.62,34.48 U2.4 | IN.3 41.66,37.04 arc-90 37.1,41.6 v37.1,43.3 | v22.7,41.5 21,37.5 v22.4,37.5 | U1.4 25.38,36.52 arc-90 25,36.9 v22.4,37.5
  Top 0.406: v4.3,30.5 v4.3,28.4
  Bottom 0.254: v22.4,37.5 22.7,37.4 arc90 v19.2,33.9 | v37.1,43.3 19.5,43.3 arc90 12,35.8 12,31.5 arc90 12.5,31 12.9,31 arc90 14.2,32.3 14.2,33 arc-90 v22.7,41.5
  Bottom 0.406: OUT.3 2.16,37.04 arc-90 4.5,34.7 4.5,30.7 arc-90 v4.3,30.5 | v4.3,28.4 4.3,27.2 arc90 6,26 16.5,26 arc90 19.2,28.4 v19.2,33.9
N$74
  Top 0.254: SV1.1 Q1.3
N$75
  Top 0.254: SV1.2 Q2.3
N$76
  Top 0.254: SV1.3 15.1,6.5 15,6.6 15,8.3 12.2,11 11.8,13.3 Q3.3
N$77
  Top 0.254: SV1.4 Q4.3
N$78
  Top 0.254: SV1.5 17.6,6.4 17,10.5 15.9,13.3 Q5.3
N$79
  Top 0.254: SV1.6 Q6.3
N$80
  Top 0.254: SV1.7 22.4,6.5 22.6,6.5 22.6,10.1 Q7.3
N$81
  Top 0.254: SV1.8 20,12.9 Q8.3
N$82
  Top 0.254: SV1.9 25,6.5 25,9.4 Q9.3
N$83
  Top 0.254: SV1.10 23.8,10.2 24.1,13.7 24.1,17.3 Q10.3
N$84
  Top 0.254: SV1.11 26.3,5.3 27.6,6.6 27.6,9.5 28,9.9 28,10.8 Q11.3
N$85
  Top 0.254: SV1.12 26.3,9.6 27.2,10.5 28.3,13.1 28.3,17.9 Q12.3
N$86
  Top 0.254: Q13.3 35.11,10.01 arc-90 31.6,6.5 30.1,6.5 30.1,6.48 SV1.13
N$87
  Top 0.254: SV1.14 29.46,7.76 33,11.3 33,18.89 Q14.3
N$88
  Top 0.254: Q15.3 arc-90 38.78,5.22 SV1.15
N$89
  Top 0.254: SV2.1 10.51,61.21 arc90 9,59.7 arc-115 Q16.3
N$90
  Top 0.254: Q17.3 SV2.2
N$91
  Top 0.254: SV2.3 16.1,60.1 15.6,59.6 13.65,59.6 Q18.3
N$92
  Top 0.254: Q19.3 13.37,67.63 arc90 14.9,65.7 arc-117 SV2.4
N$93
  Top 0.254: SV2.5 18.64,58.75 Q20.3
N$94
  Top 0.254: Q21.3 SV2.6
N$95
  Top 0.254: Q22.3 SV2.7
N$96
  Top 0.254: Q23.3 SV2.8
N$97
  Top 0.254: Q24.3 25.52,59.41 SV2.9
N$98
  Top 0.254: SV2.10 24.25,63.75 26.6,66.1 26.6,66.2 27.6,67.2 Q25.3
N$99
  Top 0.254: Q26.3 29.66,57.81 SV2.11
N$100
  Top 0.254: SV2.12 26.85,63.75 29.5,66.4 31.5,66.4 31.6,66.5 31.7,66.5 32.6,67.4 32.6,68.5 Q27.3
N$101
  Top 0.254: Q28.3 33,57.01 SV2.13
N$102
  Top 0.254: Q29.3 arc-90 35.36,65.8 30.95,65.8 arc90 SV2.14
N$103
  Top 0.254: SV2.15 34.59,60.91 arc-90 35.9,59.8 arc115 Q30.3

### Text on the board
tPlace: Left\ | By: mgregg@michaelgregg.com | Nixie Base Board V 0.2 | OUT | Pwr | IN | Gnd | r2 | +5 | Status | SCLK | SIn | r1 | Blank | Xlat | r3 | GSClk | Right
bPlace: Gnd | +5 | SCLK | SIn | Blank | Xlat | GSClk